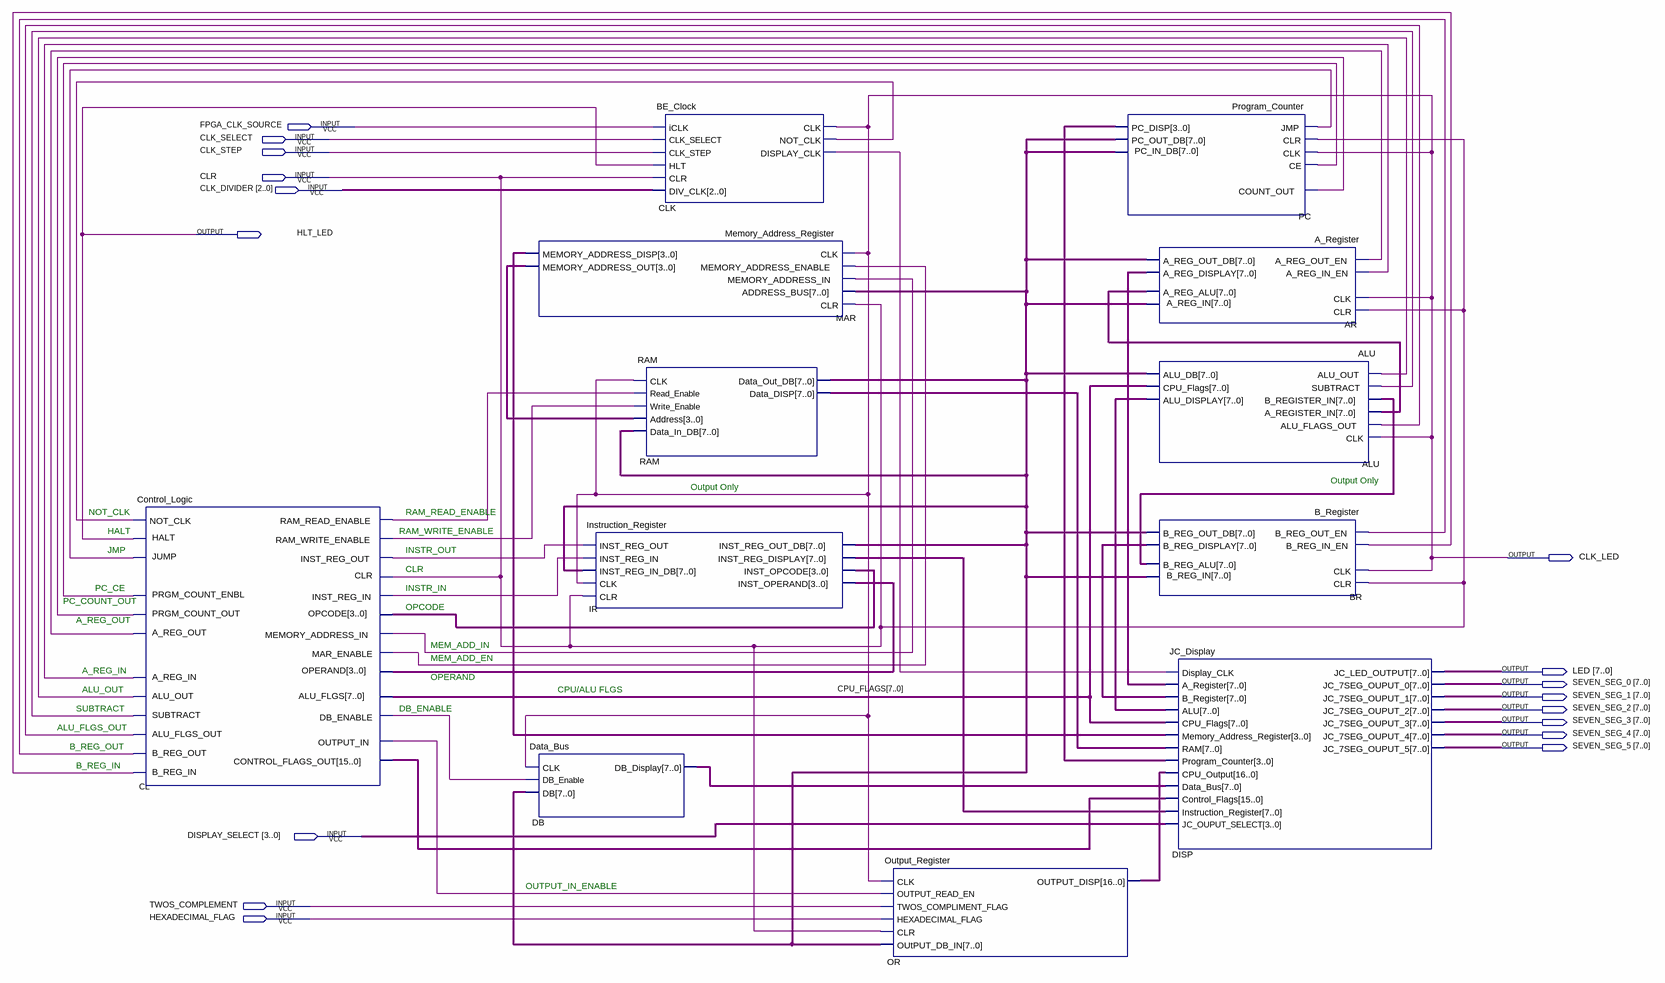
[diagram p0: schematic sheet]
// Quartus schematic BE_8_BIT_Computer.bdf as structural Verilog: 12 symbols, 17 pins
module BE_8_BIT_Computer (
  input  FPGA_CLK_SOURCE,
  input  CLK_SELECT,
  input  CLK_STEP,
  input  CLR,
  input  [2:0] CLK_DIVIDER,
  input  [3:0] DISPLAY_SELECT,
  input  TWOS_COMPLEMENT,
  input  HEXADECIMAL_FLAG,
  output HLT_LED,
  output CLK_LED,
  output [7:0] LED,
  output [7:0] SEVEN_SEG_0,
  output [7:0] SEVEN_SEG_1,
  output [7:0] SEVEN_SEG_2,
  output [7:0] SEVEN_SEG_3,
  output [7:0] SEVEN_SEG_4,
  output [7:0] SEVEN_SEG_5
);

  wire CL_a_reg_in, CL_a_reg_out, CL_alu_flgs_out, CL_alu_out, CL_b_reg_in, CL_b_reg_out, CL_db_enable,
       CL_inst_reg_in, CL_inst_reg_out, CL_jump, CL_mar_enable, CL_memory_address_in, CL_output_in,
       CL_prgm_count_enbl, CL_prgm_count_out, CL_ram_read_enable, CL_ram_write_enable, CL_subtract,
       CLK_display_clk, CLK_not_clk;
  wire [3:0] IR_inst_opcode, IR_inst_operand, MAR_memory_address_disp, MAR_memory_address_out, PC_pc_disp;
  wire [7:0] ALU_alu_display, AR_a_reg_alu, AR_a_reg_display, BR_b_reg_alu, BR_b_reg_display, CPU_FLAGS,
       DB_db_display, IR_inst_reg_display, IR_inst_reg_out_db, RAM_data_disp;
  wire [15:0] CL_control_flags_out;
  wire [16:0] OR_output_disp;

  Control_Logic CL (
    .OPCODE(IR_inst_opcode), .OPERAND(IR_inst_operand), .ALU_FLGS(CPU_FLAGS), .CLR(CLR),
    .NOT_CLK(CLK_not_clk), .HALT(HLT_LED), .JUMP(CL_jump), .PRGM_COUNT_ENBL(CL_prgm_count_enbl),
    .PRGM_COUNT_OUT(CL_prgm_count_out), .A_REG_OUT(CL_a_reg_out), .A_REG_IN(CL_a_reg_in),
    .ALU_OUT(CL_alu_out), .SUBTRACT(CL_subtract), .ALU_FLGS_OUT(CL_alu_flgs_out), .B_REG_OUT(CL_b_reg_out),
    .B_REG_IN(CL_b_reg_in), .RAM_READ_ENABLE(CL_ram_read_enable), .RAM_WRITE_ENABLE(CL_ram_write_enable),
    .INST_REG_OUT(CL_inst_reg_out), .INST_REG_IN(CL_inst_reg_in), .MEMORY_ADDRESS_IN(CL_memory_address_in),
    .MAR_ENABLE(CL_mar_enable), .DB_ENABLE(CL_db_enable), .OUTPUT_IN(CL_output_in),
    .CONTROL_FLAGS_OUT(CL_control_flags_out));
  Memory_Address_Register MAR (
    .CLK(CLK_LED), .MEMORY_ADDRESS_IN(CL_memory_address_in), .ADDRESS_BUS(IR_inst_reg_out_db), .CLR(CLR),
    .MEMORY_ADDRESS_ENABLE(CL_mar_enable), .MEMORY_ADDRESS_DISP(MAR_memory_address_disp),
    .MEMORY_ADDRESS_OUT(MAR_memory_address_out));
  Data_Bus DB (.CLK(CLK_LED), .DB_Enable(CL_db_enable), .DB(IR_inst_reg_out_db), .DB_Display(DB_db_display));
  Instruction_Register IR (
    .INST_REG_OUT(CL_inst_reg_out), .INST_REG_IN(CL_inst_reg_in), .INST_REG_IN_DB(IR_inst_reg_out_db),
    .CLK(CLK_LED), .CLR(CLR), .INST_REG_OUT_DB(IR_inst_reg_out_db), .INST_REG_DISPLAY(IR_inst_reg_display),
    .INST_OPCODE(IR_inst_opcode), .INST_OPERAND(IR_inst_operand));
  RAM RAM (
    .CLK(CLK_LED), .Read_Enable(CL_ram_read_enable), .Write_Enable(CL_ram_write_enable),
    .Address(MAR_memory_address_out), .Data_In_DB(IR_inst_reg_out_db), .Data_Out_DB(IR_inst_reg_out_db),
    .Data_DISP(RAM_data_disp));
  BE_Clock CLK (
    .iCLK(FPGA_CLK_SOURCE), .CLK_SELECT(CLK_SELECT), .CLK_STEP(CLK_STEP), .HLT(HLT_LED), .CLR(CLR),
    .DIV_CLK(CLK_DIVIDER), .CLK(CLK_LED), .NOT_CLK(CLK_not_clk), .DISPLAY_CLK(CLK_display_clk));
  Output_Register OR (
    .CLK(CLK_LED), .OUTPUT_READ_EN(CL_output_in), .TWOS_COMPLIMENT_FLAG(TWOS_COMPLEMENT),
    .HEXADECIMAL_FLAG(HEXADECIMAL_FLAG), .CLR(CLR), .OUtPUT_DB_IN(IR_inst_reg_out_db),
    .OUTPUT_DISP(OR_output_disp));
  Program_Counter PC (
    .JMP(CL_jump), .CLR(CLR), .CLK(CLK_LED), .CE(CL_prgm_count_enbl), .PC_IN_DB(IR_inst_reg_out_db),
    .COUNT_OUT(CL_prgm_count_out), .PC_DISP(PC_pc_disp), .PC_OUT_DB(IR_inst_reg_out_db));
  A_Register AR (
    .A_REG_OUT_EN(CL_a_reg_out), .A_REG_IN_EN(CL_a_reg_in), .A_REG_IN(IR_inst_reg_out_db), .CLK(CLK_LED),
    .CLR(CLR), .A_REG_OUT_DB(IR_inst_reg_out_db), .A_REG_DISPLAY(AR_a_reg_display), .A_REG_ALU(AR_a_reg_alu));
  ALU ALU (
    .ALU_OUT(CL_alu_out), .SUBTRACT(CL_subtract), .B_REGISTER_IN(BR_b_reg_alu), .A_REGISTER_IN(AR_a_reg_alu),
    .ALU_FLAGS_OUT(CL_alu_flgs_out), .CLK(CLK_LED), .ALU_DB(IR_inst_reg_out_db), .CPU_Flags(CPU_FLAGS),
    .ALU_DISPLAY(ALU_alu_display));
  B_Register BR (
    .B_REG_OUT_EN(CL_b_reg_out), .B_REG_IN_EN(CL_b_reg_in), .B_REG_IN(IR_inst_reg_out_db), .CLK(CLK_LED),
    .CLR(CLR), .B_REG_OUT_DB(IR_inst_reg_out_db), .B_REG_DISPLAY(BR_b_reg_display), .B_REG_ALU(BR_b_reg_alu));
  JC_Display DISP (
    .Display_CLK(CLK_display_clk), .A_Register(AR_a_reg_display), .B_Register(BR_b_reg_display),
    .ALU(ALU_alu_display), .CPU_Flags(CPU_FLAGS), .Memory_Address_Register(MAR_memory_address_disp),
    .RAM(RAM_data_disp), .Program_Counter(PC_pc_disp), .CPU_Output(OR_output_disp), .Data_Bus(DB_db_display),
    .Control_Flags(CL_control_flags_out), .Instruction_Register(IR_inst_reg_display),
    .JC_OUPUT_SELECT(DISPLAY_SELECT), .JC_LED_OUTPUT(LED), .JC_7SEG_OUPUT_0(SEVEN_SEG_0),
    .JC_7SEG_OUPUT_1(SEVEN_SEG_1), .JC_7SEG_OUPUT_2(SEVEN_SEG_2), .JC_7SEG_OUPUT_3(SEVEN_SEG_3),
    .JC_7SEG_OUPUT_4(SEVEN_SEG_4), .JC_7SEG_OUPUT_5(SEVEN_SEG_5));

  // Notes on the sheet:
  //   Output Only
  //   Output Only
  //   NOT_CLK
  //   RAM_READ_ENABLE
  //   HALT
  //   RAM_WRITE_ENABLE
  //   JMP
  //   INSTR_OUT
  //   CLR
  //   PC_CE
  //   INSTR_IN
  //   PC_COUNT_OUT
  //   OPCODE
  //   A_REG_OUT
  //   MEM_ADD_IN
  //   MEM_ADD_EN
  //   A_REG_IN
  //   OPERAND
  //   ALU_OUT
  //   CPU/ALU FLGS
  //   SUBTRACT
  //   DB_ENABLE
  //   ALU_FLGS_OUT
  //   B_REG_OUT
  //   B_REG_IN
  //   OUTPUT_IN_ENABLE
endmodule
